# Altium schematic sheet Bargraph_64_MCU.SchDoc
size A3
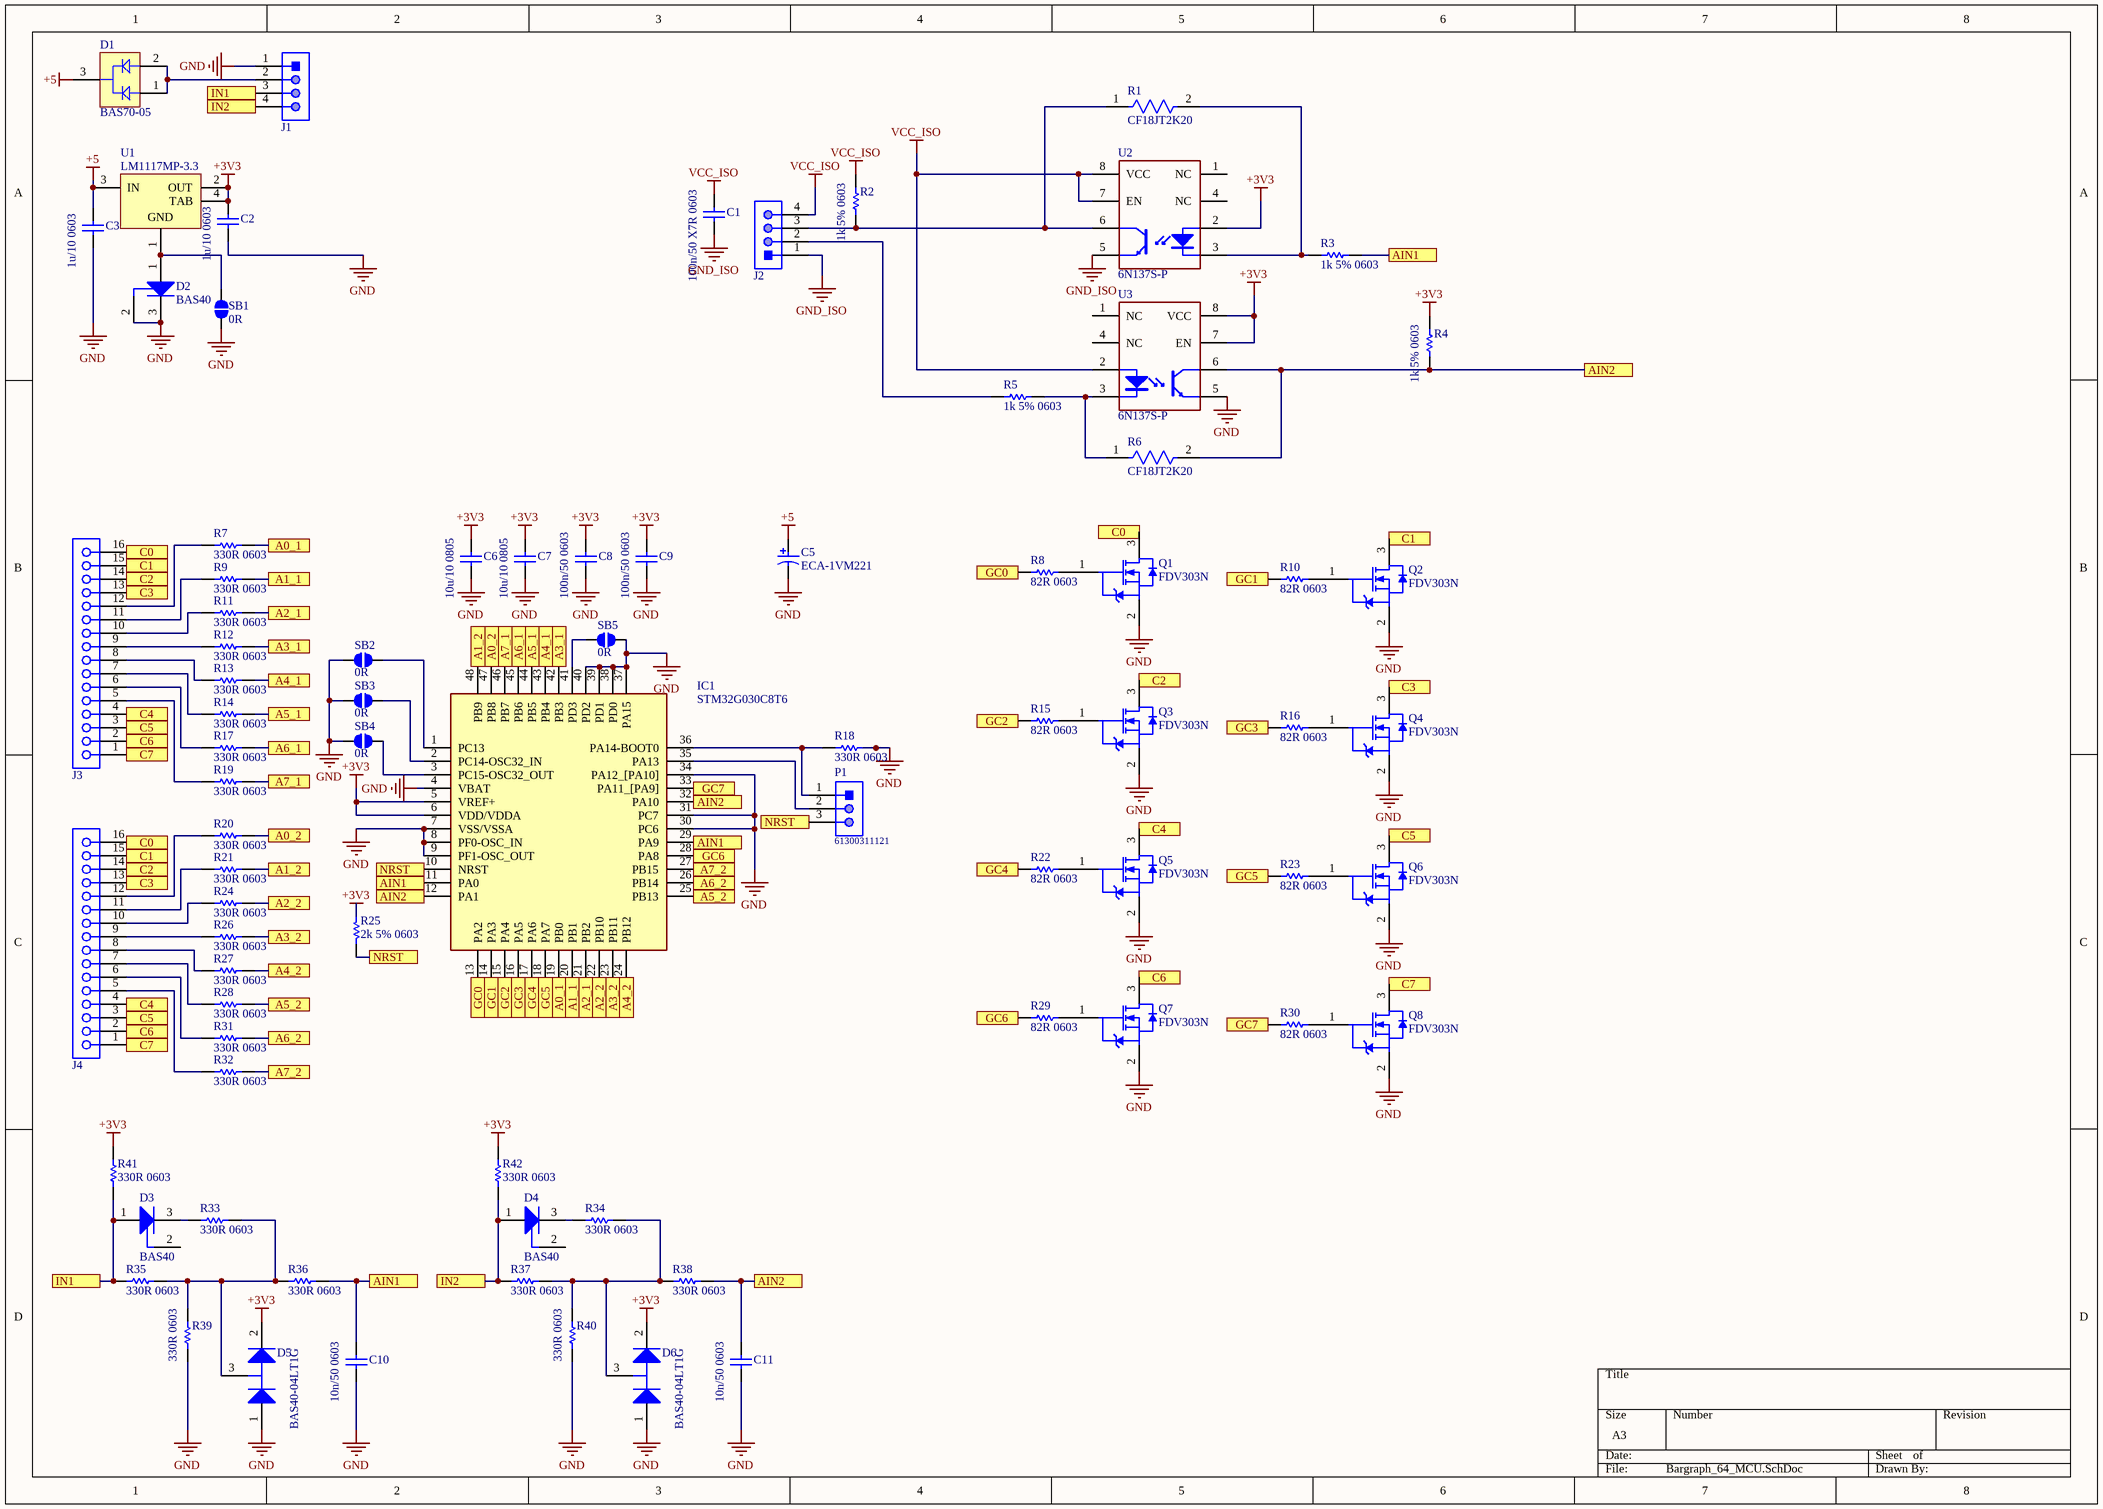
[diagram p0: Bargraph_64_MCU.SchDoc]

## Parts
C1  100n/50 X7R 0603  [CAPC1608X90X20LL10]
C2  1u/10 0603  [SAMS-C0603-2_M]
C3  1u/10 0603  [SAMS-C0603-2_M]
C5  ECA-1VM221  [PNSC-ECA-1VM221-2]
C6  10u/10 0805  [CAPC2013X140X50LL20T25]
C7  10u/10 0805  [CAPC2013X140X50LL20T25]
C8  100n/50 0603  [SAMS-C0603-2_M]
C9  100n/50 0603  [SAMS-C0603-2_M]
C10  10n/50 0603  [SAMS-C0603-2_M]
C11  10n/50 0603  [SAMS-C0603-2_M]
D1  BAS70-05  [INF-SOT23_L]
D2  BAS40  [INF-SOT23_L]
D3  BAS40  [INF-SOT23_L]
D4  BAS40  [INF-SOT23_L]
D5  BAS40-04LT1G  [ONSC-SOT-23-3-318-08_V]
D6  BAS40-04LT1G  [ONSC-SOT-23-3-318-08_V]
IC1  STM32G030C8T6  [QFP50P900X900X160-48N]
J1  CON_4  [4pos]  (value not drawn)
J2  CON_4  [4pos]  (value not drawn)
J3  16pin  [16pos_127]  (value not drawn)
J4  16pin  [16pos_127]  (value not drawn)
P1  61300311121  [61300311121]
Q1  FDV303N  [FAIR-FDV303N-3_V]
Q2  FDV303N  [FAIR-FDV303N-3_V]
Q3  FDV303N  [FAIR-FDV303N-3_V]
Q4  FDV303N  [FAIR-FDV303N-3_V]
Q5  FDV303N  [FAIR-FDV303N-3_V]
Q6  FDV303N  [FAIR-FDV303N-3_V]
Q7  FDV303N  [FAIR-FDV303N-3_V]
Q8  FDV303N  [FAIR-FDV303N-3_V]
R1  CF18JT2K20  [FP-CF18-MFG]
R2  1k 5% 0603  [RESC1609X50X30ML10T20]
R3  1k 5% 0603  [RESC1609X50X30ML10T20]
R4  1k 5% 0603  [RESC1609X50X30ML10T20]
R5  1k 5% 0603  [RESC1609X50X30ML10T20]
R6  CF18JT2K20  [FP-CF18-MFG]
R7  330R 0603  [RESC1608X55X30ML20T20]
R8  82R 0603  [RESC1608X55X30ML20T20]
R9  330R 0603  [RESC1608X55X30ML20T20]
R10  82R 0603  [RESC1608X55X30ML20T20]
R11  330R 0603  [RESC1608X55X30ML20T20]
R12  330R 0603  [RESC1608X55X30ML20T20]
R13  330R 0603  [RESC1608X55X30ML20T20]
R14  330R 0603  [RESC1608X55X30ML20T20]
R15  82R 0603  [RESC1608X55X30ML20T20]
R16  82R 0603  [RESC1608X55X30ML20T20]
R17  330R 0603  [RESC1608X55X30ML20T20]
R18  330R 0603  [RESC1608X55X30ML20T20]
R19  330R 0603  [RESC1608X55X30ML20T20]
R20  330R 0603  [RESC1608X55X30ML20T20]
R21  330R 0603  [RESC1608X55X30ML20T20]
R22  82R 0603  [RESC1608X55X30ML20T20]
R23  82R 0603  [RESC1608X55X30ML20T20]
R24  330R 0603  [RESC1608X55X30ML20T20]
R25  2k 5% 0603  [RESC1608X55X30ML20T20]
R26  330R 0603  [RESC1608X55X30ML20T20]
R27  330R 0603  [RESC1608X55X30ML20T20]
R28  330R 0603  [RESC1608X55X30ML20T20]
R29  82R 0603  [RESC1608X55X30ML20T20]
R30  82R 0603  [RESC1608X55X30ML20T20]
R31  330R 0603  [RESC1608X55X30ML20T20]
R32  330R 0603  [RESC1608X55X30ML20T20]
R33  330R 0603  [RESC1608X55X30ML20T20]
R34  330R 0603  [RESC1608X55X30ML20T20]
R35  330R 0603  [RESC1608X55X30ML20T20]
R36  330R 0603  [RESC1608X55X30ML20T20]
R37  330R 0603  [RESC1608X55X30ML20T20]
R38  330R 0603  [RESC1608X55X30ML20T20]
R39  330R 0603  [RESC1608X55X30ML20T20]
R40  330R 0603  [RESC1608X55X30ML20T20]
R41  330R 0603  [RESC1608X55X30ML20T20]
R42  330R 0603  [RESC1608X55X30ML20T20]
SB1  0R  [SB0603]
SB2  0R  [SB0603]
SB3  0R  [SB0603]
SB4  0R  [SB0603]
SB5  0R  [SB0603]
U1  LM1117MP-3.3  [MP04A_M]
U2  6N137S-P  [dip8_smd]
U3  6N137S-P  [dip8_smd]

## Ports
A0_1, A0_2, A1_1, A1_2, A2_1, A2_2, A3_1, A3_2, A4_1, A4_2, A5_1, A5_2, A6_1, A6_2, A7_1, A7_2, AIN1, AIN2, C0, C1, C2, C3, C4, C5, C6, C7, GC0, GC1, GC2, GC3, GC4, GC5, GC6, GC7, IN1, IN2, NRST

## Nets
+3V3: C2.2 C6.2 C7.2 C8.2 C9.2 D5.2(K) D6.2(K) IC1.5(VREF+) IC1.6(VDD/VDDA) R4.2 R25.2 R41.2 R42.2 U1.2(OUT) U1.4(TAB) U2.2(ANODE) U3.7(EN) U3.8(VCC)
+5: C3.2 C5.1 D1.3(K) U1.3(IN)
GND: C2.1 C3.1 C5.2 C6.1 C7.1 C8.1 C9.1 C10.1 C11.1 D2.2(NC) D2.3(K) D5.1(A) D6.1(A) IC1.4(VBAT) IC1.7(VSS/VSSA) IC1.8(PF0-OSC_IN) IC1.9(PF1-OSC_OUT) IC1.30(PC6) IC1.31(PC7) IC1.34(PA12_[PA10]) IC1.37(PA15) IC1.38(PD0) IC1.39(PD1) IC1.40(PD2) J1.1 Q1.2(S) Q2.2(S) Q3.2(S) Q4.2(S) Q5.2(S) Q6.2(S) Q7.2(S) Q8.2(S) R18.2 R39.1 R40.1 SB1.2 SB2.2 SB3.2 SB4.2 SB5.1 U3.5(EMITTER)
GND_ISO: C1.1 J2.1 U2.5(EMITTER)
VCC_ISO: C1.2 J2.4 R2.2 U2.7(EN) U2.8(VCC) U3.2(ANODE)
A0_1: IC1.19(PB0) R7.2 ; port A0_1
A0_2: IC1.47(PB8) R20.2 ; port A0_2
A1_1: IC1.20(PB1) R9.2 ; port A1_1
A1_2: IC1.48(PB9) R21.2 ; port A1_2
A2_1: IC1.21(PB2) R11.2 ; port A2_1
A2_2: IC1.22(PB10) R24.2 ; port A2_2
A3_1: IC1.42(PB3) R12.2 ; port A3_1
A3_2: IC1.23(PB11) R26.2 ; port A3_2
A4_1: IC1.43(PB4) R13.2 ; port A4_1
A4_2: IC1.24(PB12) R27.2 ; port A4_2
A5_1: IC1.44(PB5) R14.2 ; port A5_1
A5_2: IC1.25(PB13) R28.2 ; port A5_2
A6_1: IC1.45(PB6) R17.2 ; port A6_1
A6_2: IC1.26(PB14) R31.2 ; port A6_2
A7_1: IC1.46(PB7) R19.2 ; port A7_1
A7_2: IC1.27(PB15) R32.2 ; port A7_2
AIN1: C10.2 IC1.11(PA0) IC1.29(PA9) R3.1 R36.2 ; port AIN1
AIN2: C11.2 IC1.12(PA1) IC1.32(PA10) R4.1 R6.2 R38.2 U3.6(COLLECTOR) ; port AIN2
C0: J3.16 J4.16 Q1.3(D) ; port C0
C1: J3.15 J4.15 Q2.3(D) ; port C1
C2: J3.14 J4.14 Q3.3(D) ; port C2
C3: J3.13 J4.13 Q4.3(D) ; port C3
C4: J3.4 J4.4 Q5.3(D) ; port C4
C5: J3.3 J4.3 Q6.3(D) ; port C5
C6: J3.2 J4.2 Q7.3(D) ; port C6
C7: J3.1 J4.1 Q8.3(D) ; port C7
GC0: IC1.13(PA2) R8.1 ; port GC0
GC1: IC1.14(PA3) R10.1 ; port GC1
GC2: IC1.15(PA4) R15.1 ; port GC2
GC3: IC1.16(PA5) R16.1 ; port GC3
GC4: IC1.17(PA6) R22.1 ; port GC4
GC5: IC1.18(PA7) R23.1 ; port GC5
GC6: IC1.28(PA8) R29.1 ; port GC6
GC7: IC1.33(PA11_[PA9]) R30.1 ; port GC7
IN1: D3.1(A) J1.3 R35.1 R41.1 ; port IN1
IN2: D4.1(A) J1.4 R37.1 R42.1 ; port IN2
NRST: IC1.10(NRST) P1.3 R25.1 ; port NRST
NetD1_1: D1.1(A1) D1.2(A2) J1.2
NetD2_1: D2.1(A) SB1.1 U1.1(GND)
NetD3_3: D3.3(K) R33.1
NetD4_3: D4.3(K) R34.1
NetD5_3: D5.3(K/A) R33.2 R35.2 R36.1 R39.2
NetD6_3: D6.3(K/A) R34.2 R37.2 R38.1 R40.2
NetIC1_1: IC1.1(PC13) SB2.1
NetIC1_2: IC1.2(PC14-OSC32_IN) SB3.1
NetIC1_3: IC1.3(PC15-OSC32_OUT) SB4.1
NetIC1_35: IC1.35(PA13) P1.2
NetIC1_36: IC1.36(PA14-BOOT0) P1.1 R18.1
NetIC1_41: IC1.41(PD3) SB5.2
NetJ2_2: J2.2 R5.2
NetJ2_3: J2.3 R1.1 R2.1 U2.6(COLLECTOR)
NetJ3_5: J3.5 R19.1
NetJ3_6: J3.6 R17.1
NetJ3_7: J3.7 R14.1
NetJ3_8: J3.8 R13.1
NetJ3_9: J3.9 R12.1
NetJ3_10: J3.10 R11.1
NetJ3_11: J3.11 R9.1
NetJ3_12: J3.12 R7.1
NetJ4_5: J4.5 R32.1
NetJ4_6: J4.6 R31.1
NetJ4_7: J4.7 R28.1
NetJ4_8: J4.8 R27.1
NetJ4_9: J4.9 R26.1
NetJ4_10: J4.10 R24.1
NetJ4_11: J4.11 R21.1
NetJ4_12: J4.12 R20.1
NetQ1_1: Q1.1(G) R8.2
NetQ2_1: Q2.1(G) R10.2
NetQ3_1: Q3.1(G) R15.2
NetQ4_1: Q4.1(G) R16.2
NetQ5_1: Q5.1(G) R22.2
NetQ6_1: Q6.1(G) R23.2
NetQ7_1: Q7.1(G) R29.2
NetQ8_1: Q8.1(G) R30.2
NetR1_2: R1.2 R3.2 U2.3(CATHODE)
NetR5_1: R5.1 R6.1 U3.3(CATHODE)

Not connected (* = marked no-connect by the designer): D3 2(NC); D4 2(NC); U2 1(NC) 4(NC); U3 1(NC) 4(NC)

## Library data of the parts
C1 = CMP-2000-07546-1: Chip Capacitor, 0.1 uF, +/- 10%, 50 V, -55 to 125 degC, 0603 (1608 Metric), RoHS, Tape and Reel; Manufacturer: TDK; Capacitance: 100nF; Voltage: 50V; Package Reference: 603; Radiation Hardening: No; Composition: Ceramic; Datasheet URL: https://product.tdk.com/info/en/catalog/datasheets/mlcc_automotive_general_en.pdf; Mounting Technology: SurfaceMount; Datasheet Version: 12/2014; Width: 0.8mm; Length: 1.6mm; Tolerance: 10%; Case Code (Imperial): 0603; RoHSCompliant: True; Min Operating Temperature: -55degC; Package Description: 2-Pin Surface Mount Device, Body 1.6 x 0.8 mm; Packaging: TapeandReel; Package Quantity: 1; Voltage Rating: 50V; Mount: SurfaceMount; Lead Free: LeadFree; Depth: 0.8mm; Termination: SMD/SMT; Case Code (Metric): 1608; Thickness: 0.035inch; Height: 0.8mm; Dielectric: X7R; Weight: 7.1E-05oz; Voltage Rating (DC): 50V; REACH SVHC: NoSVHC; Manufacturer URL: http://www.tdk.com/; Case/Package: 0603; Max Operating Temperature: 125degC
C2 C3 C8-C11 = CMP-2000-05332-1: Multi-layer Ceramic Capacitor, -55 to 125 degC, 2-Pin SMD (0603), RoHS, Tape and Reel; Manufacturer: Samsung Electro-Mechanics; Capacitance: 0.1µF; Rated Voltage: 50V; Dielectric: X7R; Tolerance (%): ±10%; Case Size/Dimension: 0603; Datasheet URL: https://datasheet.ciiva.com/29198/456651-da-01-en-vs-kondensator-0605-29198839.pdf; Manufacturer URL: http://www.samsungsem.com/global/index.jsp; Datasheet Version: Nov-10
C5 = CMP-2000-05311-1: Aluminum Electrolytic Capacitor, 220 uF, +/- 20%, 35 V, -40 to 85 degC, 2-Pin THD, RoHS, Bulk; Manufacturer: Panasonic; Lifetime@Temperature: 2000Hrs@85degC; Rated Voltage: 35V; Ripple Current: 350mA; Type: Radial; Capacitance: 220µF; Package Reference: ECA-1VM221; Series: M; Operating Temp Range: -40to+85degC; Package Description: 2-Pin Axial Lead, Dia 8 mm, Body Length 12.5 mm; Datasheet Version: Mar-06; Datasheet URL: https://datasheet.ciiva.com/26341/441851-da-01-en-elko-eca1vm221-m-r-220myf-35v-85c-26341906.pdf; Operating Temp-Max: 85degC; Case Size/Dimension: Ø8x11.5mm; Manufacturer URL: http://www.panasonic.com/
C6 C7 = CMP-2007-03243-1: Part Number: C0805C106K8PACTU; Manufacturer: Kemet
D1 = CMP-1182-00018-1: Silicon Schottky Diode, -55 to 125 degC, SOT23, Reel, Green; Manufacturer: Infineon; Green: TRUE; CT (max): 2Â pF; Configuration: Dual; VF (max): 1,000Â mV; IF (max): 70Â mA; VR (max): 70Â V; ComponentLink2URL: http://www.infineon.com/dgdl/bas70_bas170series.pdf?folderId=db3a30431400ef68011425f1ca2505e3&fileId=db3a304314dca389011518ad41680e12; PackageReference: SOT23; PackageDescription: 3-Pin Small Outline Transistor Package, 1.3 x 2.9 mm Body, 0.95 mm Pitch; Mounting Technology: Surface Mount; ComponentLink1URL: http://www.infineon.com/; ComponentLink3Description: Package Specification; PackageVersion: Apr-08; PartNumber: BAS70-05; ComponentLink1Description: Manufacturer URL; ComponentLink3URL: http://www.infineon.com/dgdl/SOT23-Package_Overview.pdf?folderId=db3a30431936bc4b0119532290053c66&fileId=db3a30431936bc4b0119533468123c85; Packing: Reel; ComponentLink2Description: Datasheet
D2-D4 = CMP-1182-00023-1: Silicon Schottky Diode, -55 to 150 degC, SOT23, Reel, Green; Manufacturer: Infineon; IF (max): 120Â mA; Configuration: Single; VR (max): 40Â V; Green: TRUE; VF (max): 1,000Â mV; CT (max): 5Â pF; PackageDescription: 3-Pin Small Outline Transistor Package, 1.3 x 2.9 mm Body, 0.95 mm Pitch; ComponentLink3Description: Package Specification; Mounting Technology: Surface Mount; PackageVersion: Apr-08; ComponentLink1Description: Manufacturer URL; ComponentLink1URL: http://www.infineon.com/; ComponentLink2URL: http://www.infineon.com/dgdl/bas40_bas140series.pdf?folderId=db3a30431400ef68011425f1ca2505e3&fileId=db3a304314dca389011518a57ed20e11; PartNumber: BAS40; ComponentLink2Description: Datasheet; PackageReference: SOT23; ComponentLink3URL: http://www.infineon.com/dgdl/SOT23-Package_Overview.pdf?folderId=db3a30431936bc4b0119532290053c66&fileId=db3a30431936bc4b0119533468123c85; Packing: Reel
D5 D6 = CMP-1055-00530-1: Dual Series Schottky Barrier Diodes, 3-Pin SOT-23, Pb-Free, Tape and Reel; Manufacturer: On Semiconductor; PackageDescription: 3-Pin Small Outline Transistor, Body 2.92 x 1.3 mm, Pitch 0.95 mm; ComponentLink1Description: Manufacturer URL; PackageReference: SOT-23-3-318-08; PackageVersion: Rev. AP, 11/2009; Mounting Technology: Surface Mount; Configuration: Series; RoHS: TRUE; ComponentLink2URL: http://www.onsemi.cn/pub_link/Collateral/BAS40-04LT1-D.PDF; ComponentLink3URL: http://www.onsemi.cn/pub_link/Collateral/318-08.PDF; DatasheetVersion: Rev. 11; ComponentLink2Description: Datasheet; ComponentLink3Description: Package Specification; Packing: Tape and Reel; PartNumber: BAS40-04LT1G; ComponentLink1URL: http://www.onsemi.com/
IC1 = STM32G030C8T6: Integrated Circuit; Manufacturer_Name: STMicroelectronics; Datasheet Link: https://componentsearchengine.com/Datasheets/1/STM32G030C8T6.pdf; Height: 1.6mm; Manufacturer_Part_Number: STM32G030C8T6; Arrow Part Number: STM32G030C8T6; Arrow Price/Stock: https://www.arrow.com/en/products/stm32g030c8t6/stmicroelectronics; Mouser Part Number: 511-STM32G030C8T6; Mouser Price/Stock: https://www.mouser.co.uk/ProductDetail/STMicroelectronics/STM32G030C8T6?qs=uwxL4vQweFMKBA8wRRkiWA%3D%3D
J1 J2 = CON_4: THT Vertical Pin Header WR-PHD, Pitch 2.54 mm, Single Row; Part Number: 61300311121; Manufacturer: Wurth Elektronik; Withstanding Voltage: 500VAC; Working Voltage: 250VAC; Rated Current: 3A; Pitch: 2.54mm; Pin Number: 3; Gender: Male; Contact Resistance: 20mOhm; Package Reference: 61300311121; Manufacturer URL: http://www.we-online.de; Datasheet URL: https://katalog.we-online.de/em/datasheet/6130xx11121.pdf; Operating Temperature: -40to105degC; Orientation: Vertical; Packaging: Bag; Row Number: Single; Mounting Technology: THT; Publisher: WurthElektronik
J3 J4 = 16pin: SQ Post Socket, Through-hole, Vertical, -55 to 125 degC, 1.,27 mm Pitch, 16-Pin, male, RoHS; PartNumber: SSW-116-02-G-S; Manufacturer: Samtec; Pitch: 2.54 mm; ComponentLink2URL: http://www.samtec.com/documents/webfiles/pdf/SSW_TH.PDF; Mounting Technology: Through-hole; ComponentLink1URL: http://www.samtec.com; ComponentLink3Description: Package Specification; Orientation: Vertical; PackageVersion: CA, 6/1987; Temperature Range: -55 to 125 degC; ComponentLink2Description: Datasheet; PackageDescription: Assembly, Socket Strip .016 X .031 Tail; DatasheetVersion: F-214; ComponentLink1Description: Manufacturer URL; ComponentLink3URL: http://www.samtec.com/documents/webfiles/cpdf/SSW-1XX-XX-XXX-X-XX-XXX-XX-MKT.pdf; PackageReference: SSW-116-02-X-S; RoHS: True
P1 = CMP-1502-01062-1: THT Vertical Pin Header WR-PHD, Pitch 2.54 mm, Single Row, 3 pins; Manufacturer: Wurth Elektronik; Withstanding Voltage: 500VAC; Working Voltage: 250VAC; Rated Current: 3A; Pitch: 2.54mm; Pin Number: 3; Gender: Male; Contact Resistance: 20mOhm; Package Reference: 61300311121; Manufacturer URL: http://www.we-online.de; Datasheet URL: https://katalog.we-online.de/em/datasheet/6130xx11121.pdf; Operating Temperature: -40to105degC; Part Number: 61300311121; Orientation: Vertical; Packaging: Bag; Row Number: Single; Mounting Technology: THT; Publisher: WurthElektronik
Q1-Q8 = CMP-2000-05111-1: N-Channel MOSFET Transistor, 8 V VGSS, 25 V VDSS, 0.68 A, -55 to 150 degC, 3-Pin SOT23, RoHS, Tape and Reel; Manufacturer: Fairchild; Typical Turn-On Delay Time: 3ns; Channel Mode: Enhancement; RDS-on: 450@4.5VmOhm; Maximum Continuous Drain Current: 0.68A; Maximum Drain Source Voltage: 25V; Rad Hard: No; Typical Fall Time: 13ns; Channel Type: N; Typical Turn-Off Delay Time: 17ns; Maximum Gate Source Voltage: 8V; Typical Rise Time: 8.5ns; Mounting: SurfaceMount; Packaging: Tape&Reel; Manufacturer URL: https://www.fairchildsemi.com/; Datasheet URL: https://datasheet.ciiva.com/22681/1845307-22681736.pdf; Package: 3SOT-23; Category: MOSFET; Operating Temperature: -55to150degC; Datasheet Version: Rev. D2, 07/2014
R1 R6 = CMP-26528-000001-1: RES 2.2K OHM 1/8W 5% CF AXIAL; Manufacturer: Stackpole Electronics Inc; Description: RES 2.2K OHM 1/8W 5% AXIAL; Value: 2.2kΩ; Voltage Rating: 250V; Temperature Coefficient: 0/-400ppm/°C; Power Rating: 0.125W; Composition: Carbon Film; Octopart: https://octopart.com/cf18jt2k20-stackpole+electronics-19205714; Tolerance: 5%; Series: CF; Temperature Range Low: -55°C; ComponentLink2URL: https://www.seielect.com/catalog/sei-cf_cfm.pdf; Ipc Land Pattern Name: RESAD656W65L360D200; Package: CF18; Device Class L2: Resistors; Device Class L3: Through-Hole Resistors; Resistance: 2.2kΩ; Height: 2mm; Category: Res; ComponentLink2Description: Datasheet; Manufacturer Part Number: CF18JT2K20; Lead Free: Yes; Temperature Range High: +155°C; Temperature: -55°C to +155°C; RoHS: TRUE; Device Class L1: Passive Components; Digikey Description: RES 2.2K OHM 1/8W 5% CF AXIAL; Automotive: No
R2-R5 = CMP-2000-03379-1: Manufacturer: Vishay Dale; Part Number: CRCW060347K0FKEA
R7-R42 = CMP-2000-00873-1: Manufacturer: Panasonic; Part Number: ERA3AEB102V
SB1-SB5 = SB: Manufacturer: Panasonic; Part Number: ERA3AEB102V
U1 = CMP-0062-01658-3: 800mA Low-Dropout Linear Regulator, 4-pin SOT-223; Manufacturer: National Semiconductor; High-Reliability: Y; PackageTopMarking: XYTT*N05A; PowerWise: N; CompType: LDO IC; PackageReference: MP04A; Code_IPC: SOT223-4; Code_JEDEC: TO-261-AA; PinCount: 4; ComponentLink3Description: LM1117 Web Page; PackageVersion: revB, Apr-2003; RoHS: N; ComponentLink4URL: http://www.national.com/packaging/folders/mp04a.html; ComponentLink2URL: http://www.national.com/ds/LM/LM1117.pdf; ComponentLink1URL: http://www.national.com/; ComponentLink1Description: Manufacturer URL; RevisionNote: SCH symbol layout adjusted; DatasheetVersion: Apr-2006; PackageDescription: Molded SOT-223, 6.50 x 3.56 x 1.6mm Body, 4 Lead, 2.3mm Pitch; PartNumber: LM1117MP-3.3; ComponentLink4Description: MP04A Package Page; ComponentLink2Description: LM1117 Datasheet; ComponentLink3URL: http://www.national.com/pf/LM/LM1117.html
U2 U3 = 6N137S-P: Phototransistor Optocoupler, 4 us Rise, 3 us Fall, 5000 Vrms, -55 to 110 degC, 4-Pin MDIP, RoHS, Tape and Reel; Manufacturer: Fairchild Semiconductor; Current Transfer Ratio (Min): 300%@5mA; Rise / Fall Time (Typ): 4µs,3µs; Vce Saturation (Max): 200mV; Current Transfer Ratio (Max): 600%@5mA; Package Version: 10/2014; Current - DC Forward (If) (Max): 50mA; Online Catalog: FOD617,814,817Series; Voltage - Output (Max): 70V; Number of Channels: 1; Input Type: DC; Voltage - Forward (Vf) (Typ): 1.2V; Other Names: FOD817DSDDKR; Output Type: Transistor; Packaging: Digi-Reel®; Category: Isolators; Package / Case: 4-SMD,GullWing; Voltage - Isolation: 5000Vrms; Mounting Technology: SurfaceMount; Series: -; Mounting Type: SurfaceMount; Supplier Device Package: 4-SMD; Family: Optoisolators-Transistor,PhotovoltaicOutput; Standard Package: 1; Package Description: 4-Pin Surface Mount Device, Body 6.5 x 4.6 mm, Pitch 2.54 mm; Datasheet Version: Rev. 2.8, 11/2015; Package Reference: MDIP 4L; Manufacturer URL: https://www.fairchildsemi.com/; Current - Output / Channel: 50mA; Turn On / Turn Off Time (Typ): -; Operating Temperature: -55°C~110°C; Datasheet URL: https://www.fairchildsemi.com/datasheets/FO/FOD817D.pdf; Package URL: https://www.fairchildsemi.com/package-drawings/N0/N04C.pdf